# EAGLE board imu_v2 (EAGLE 6.4), part 1 of 2
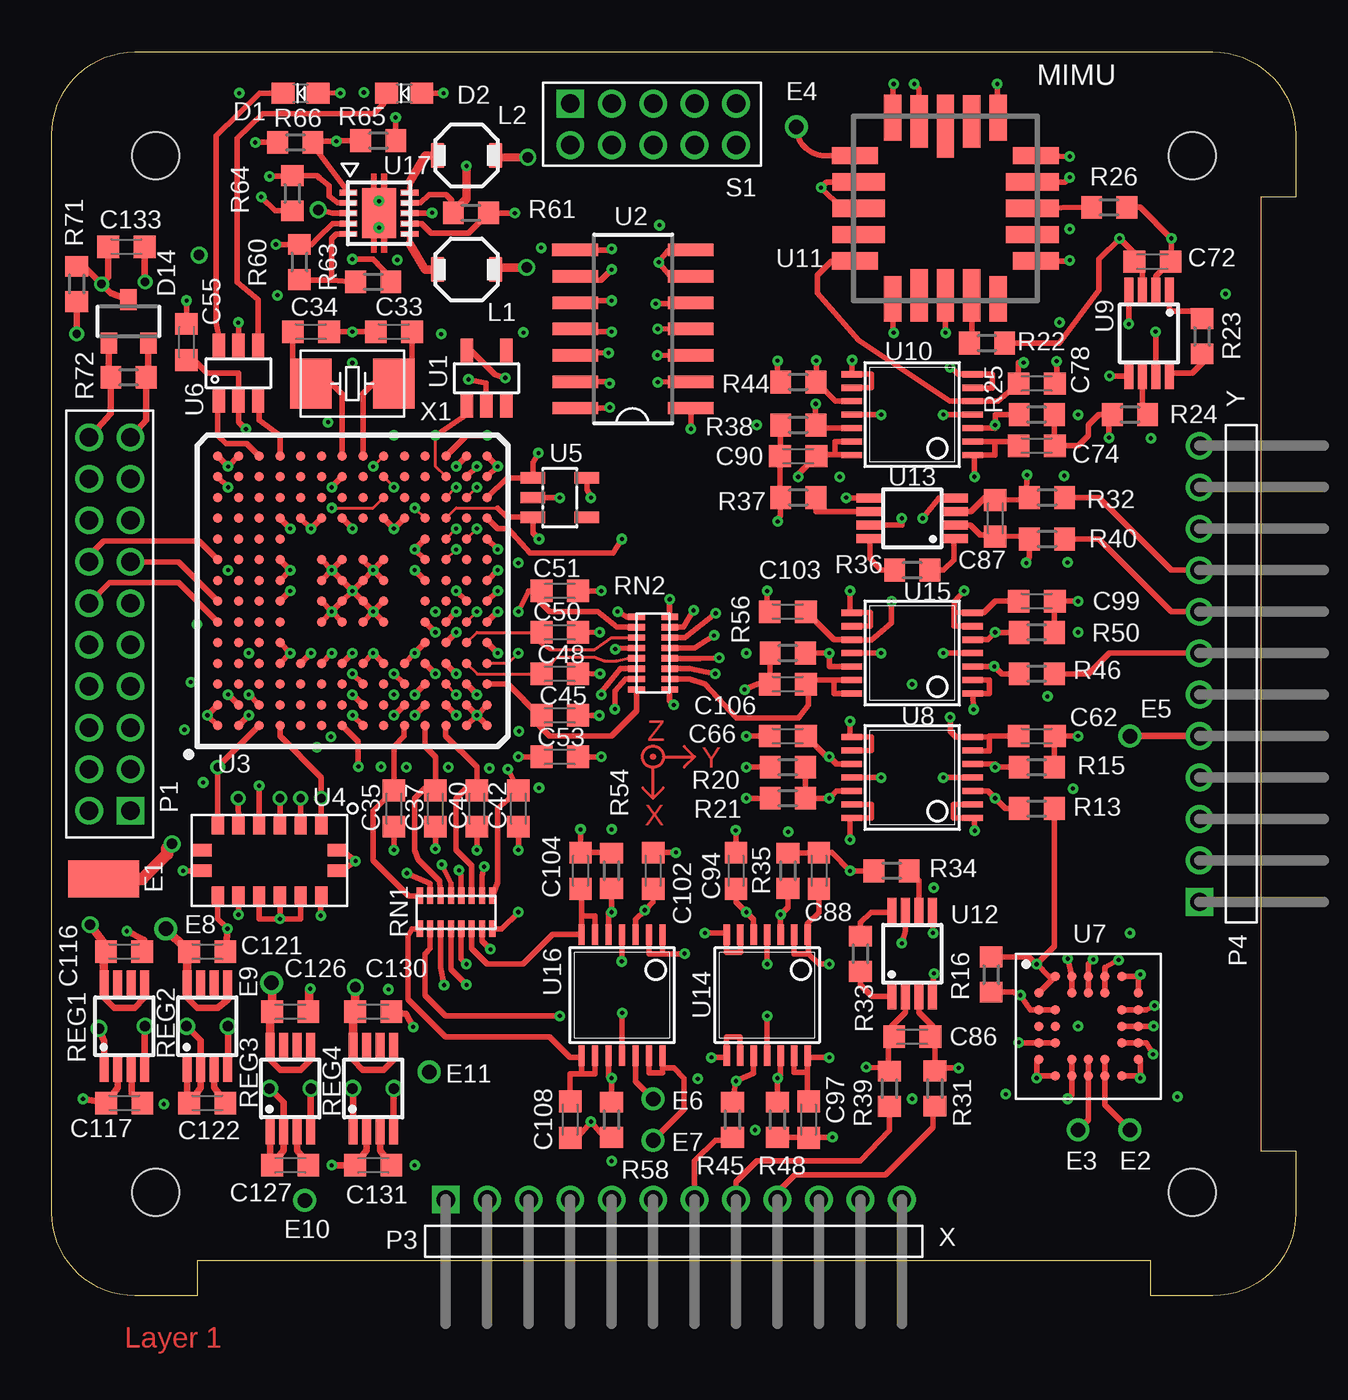
[diagram p4: board, top side]
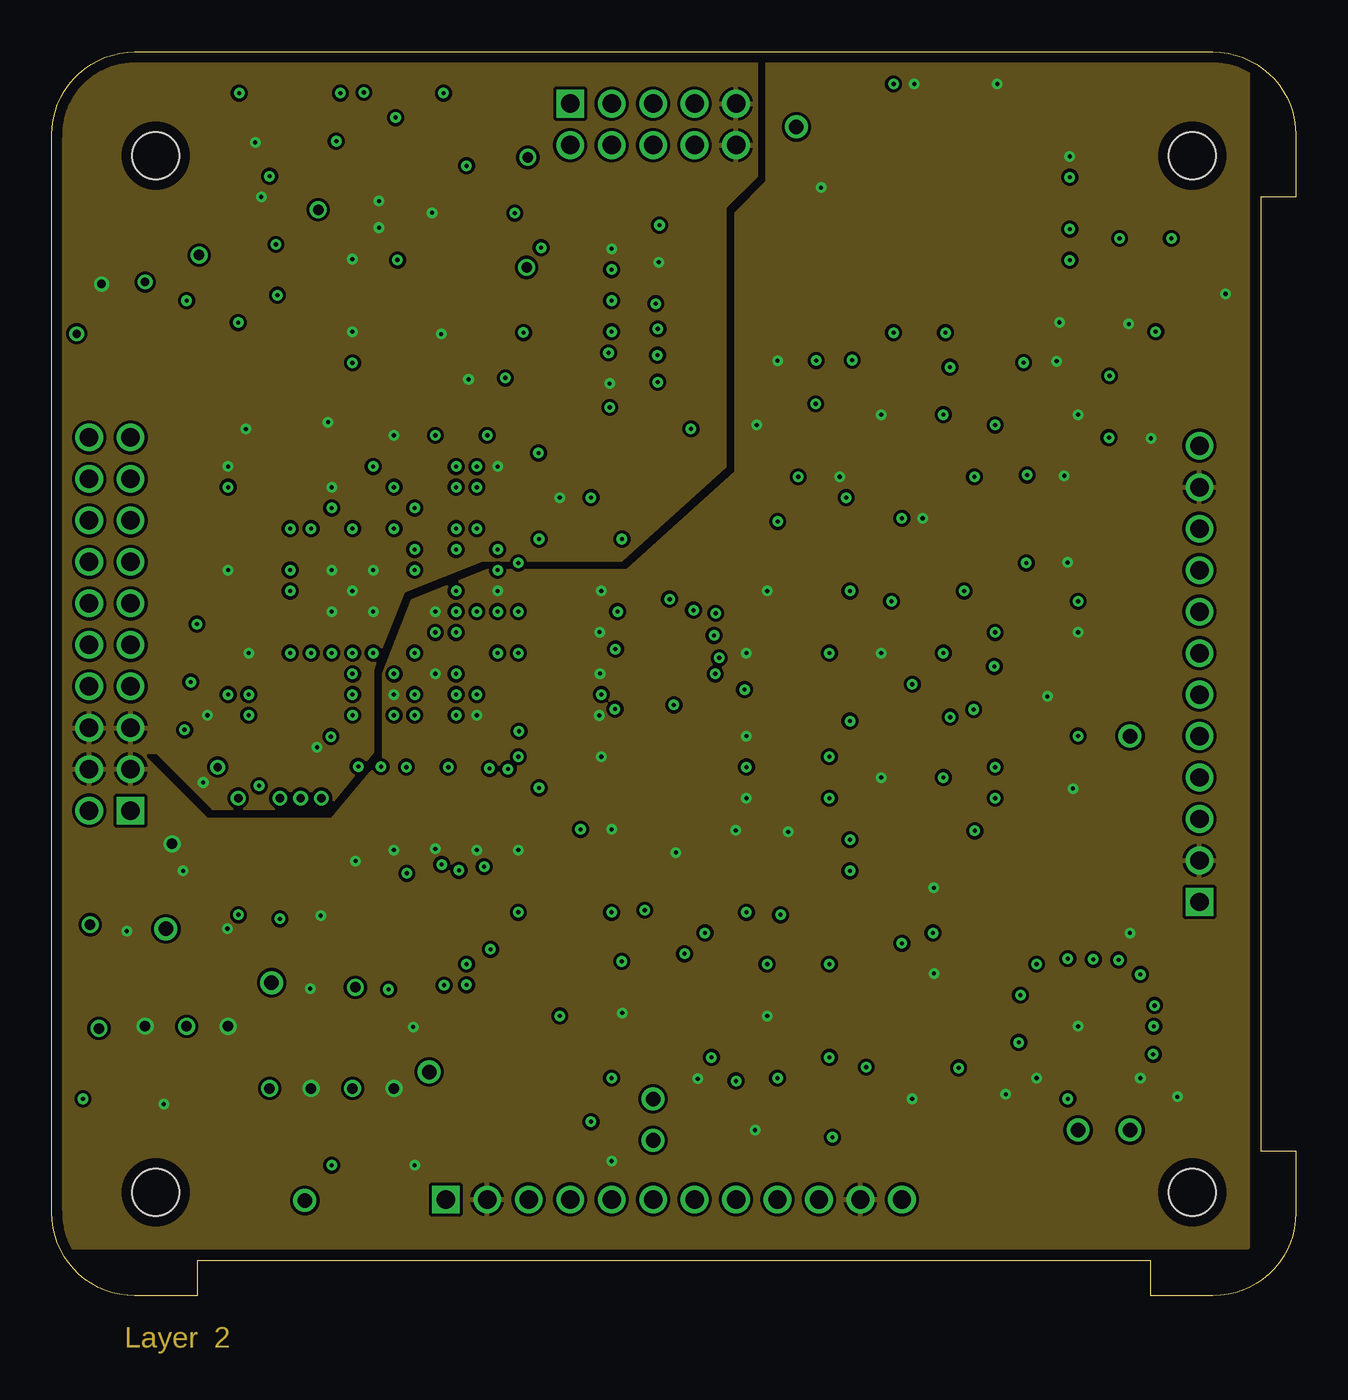
[diagram p5: board, inner layer Gnd]
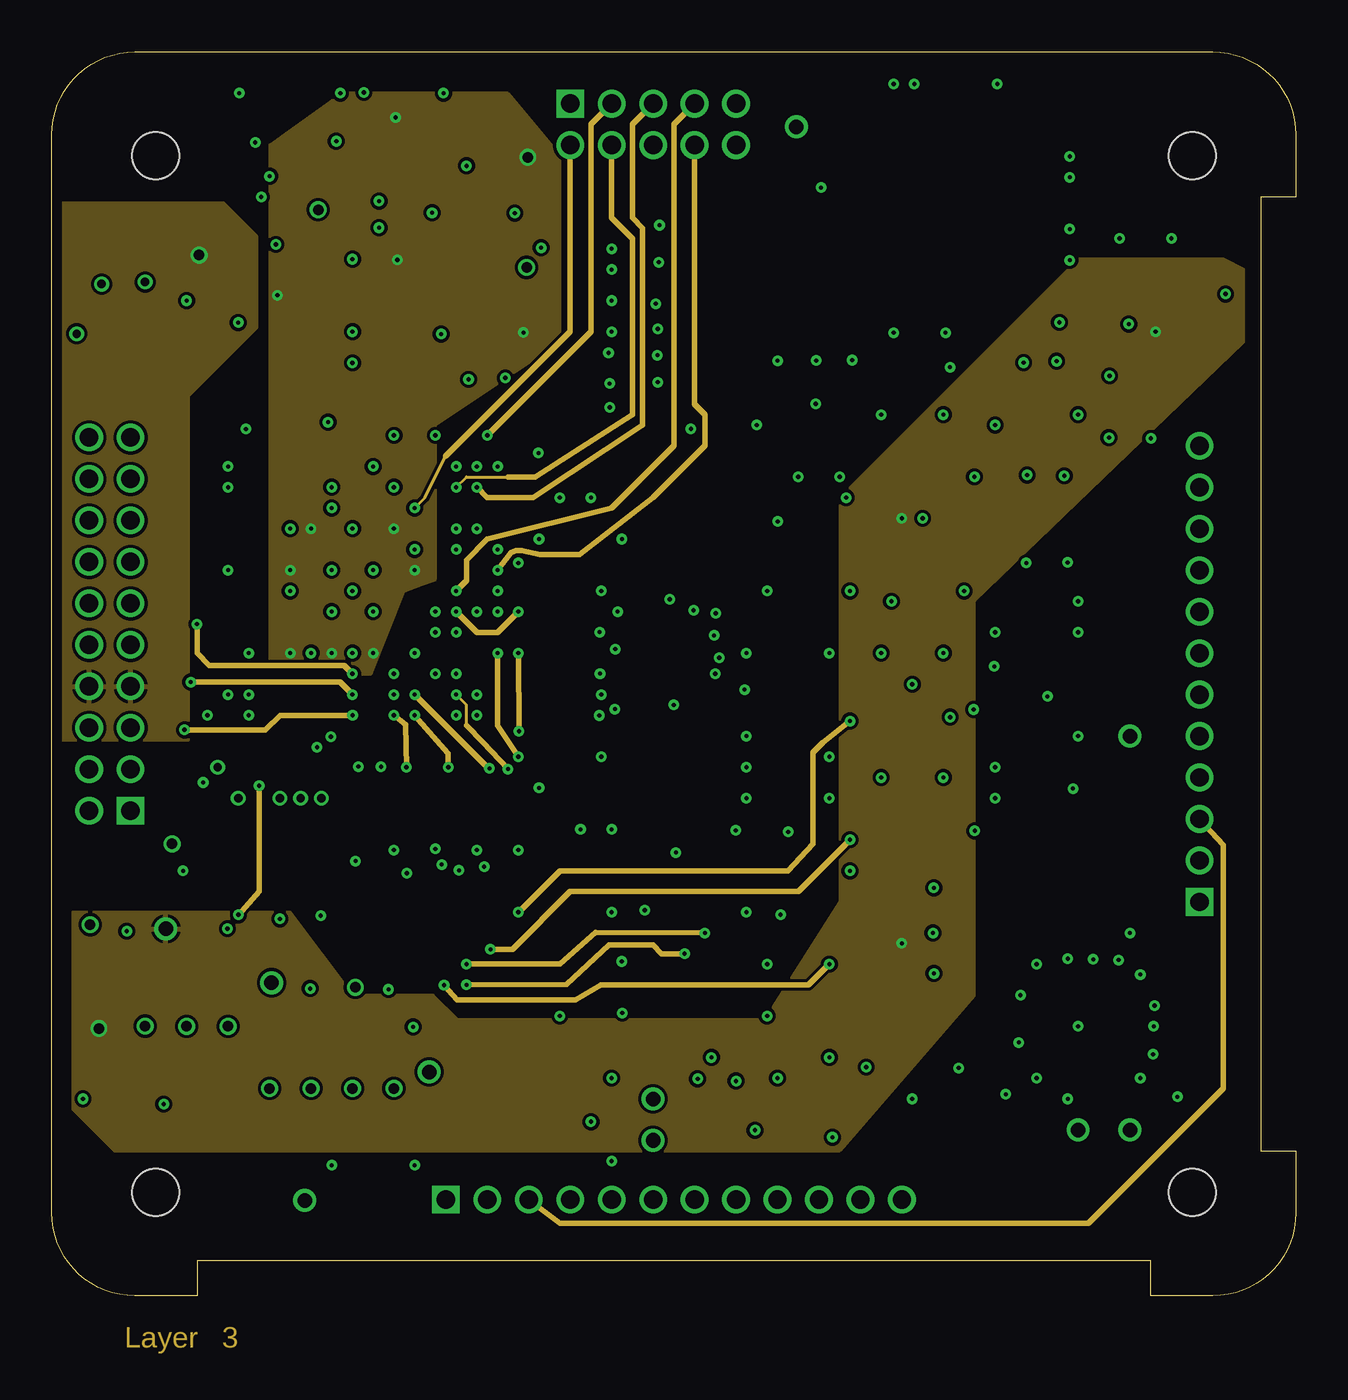
[diagram p6: board, inner layer Sig1]
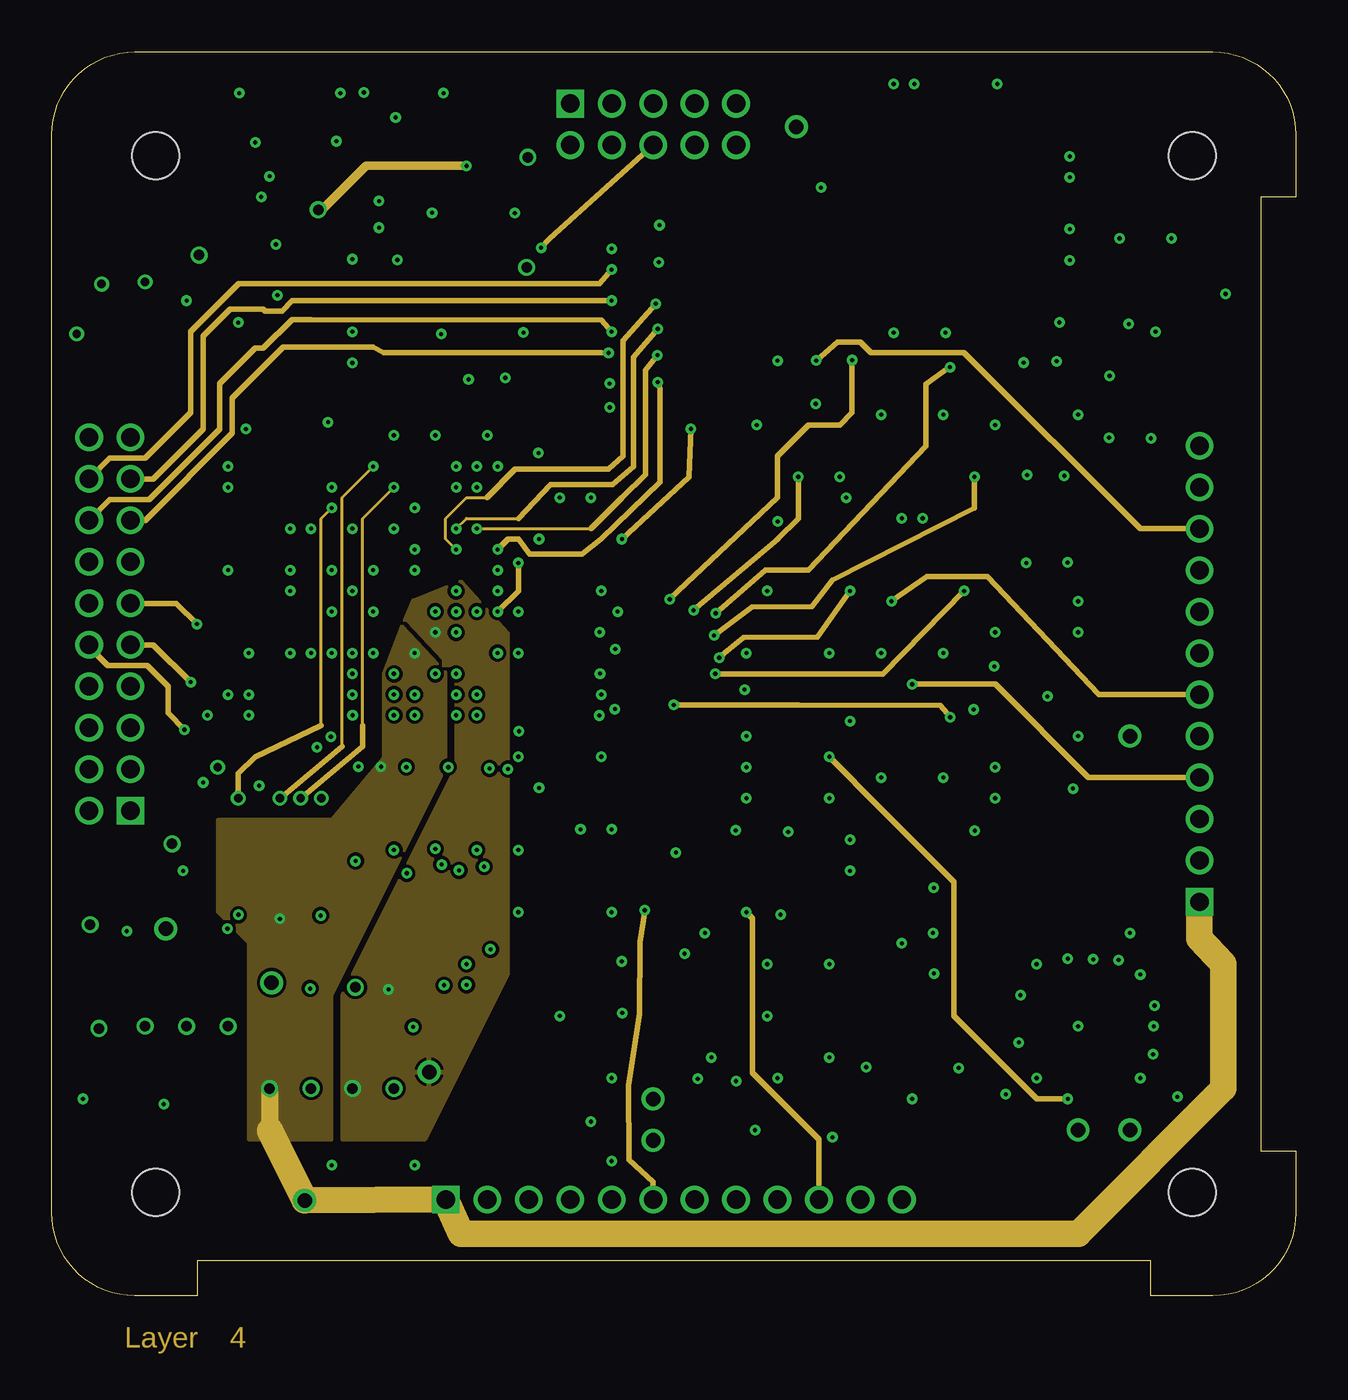
[diagram p7: board, inner layer Sig2]
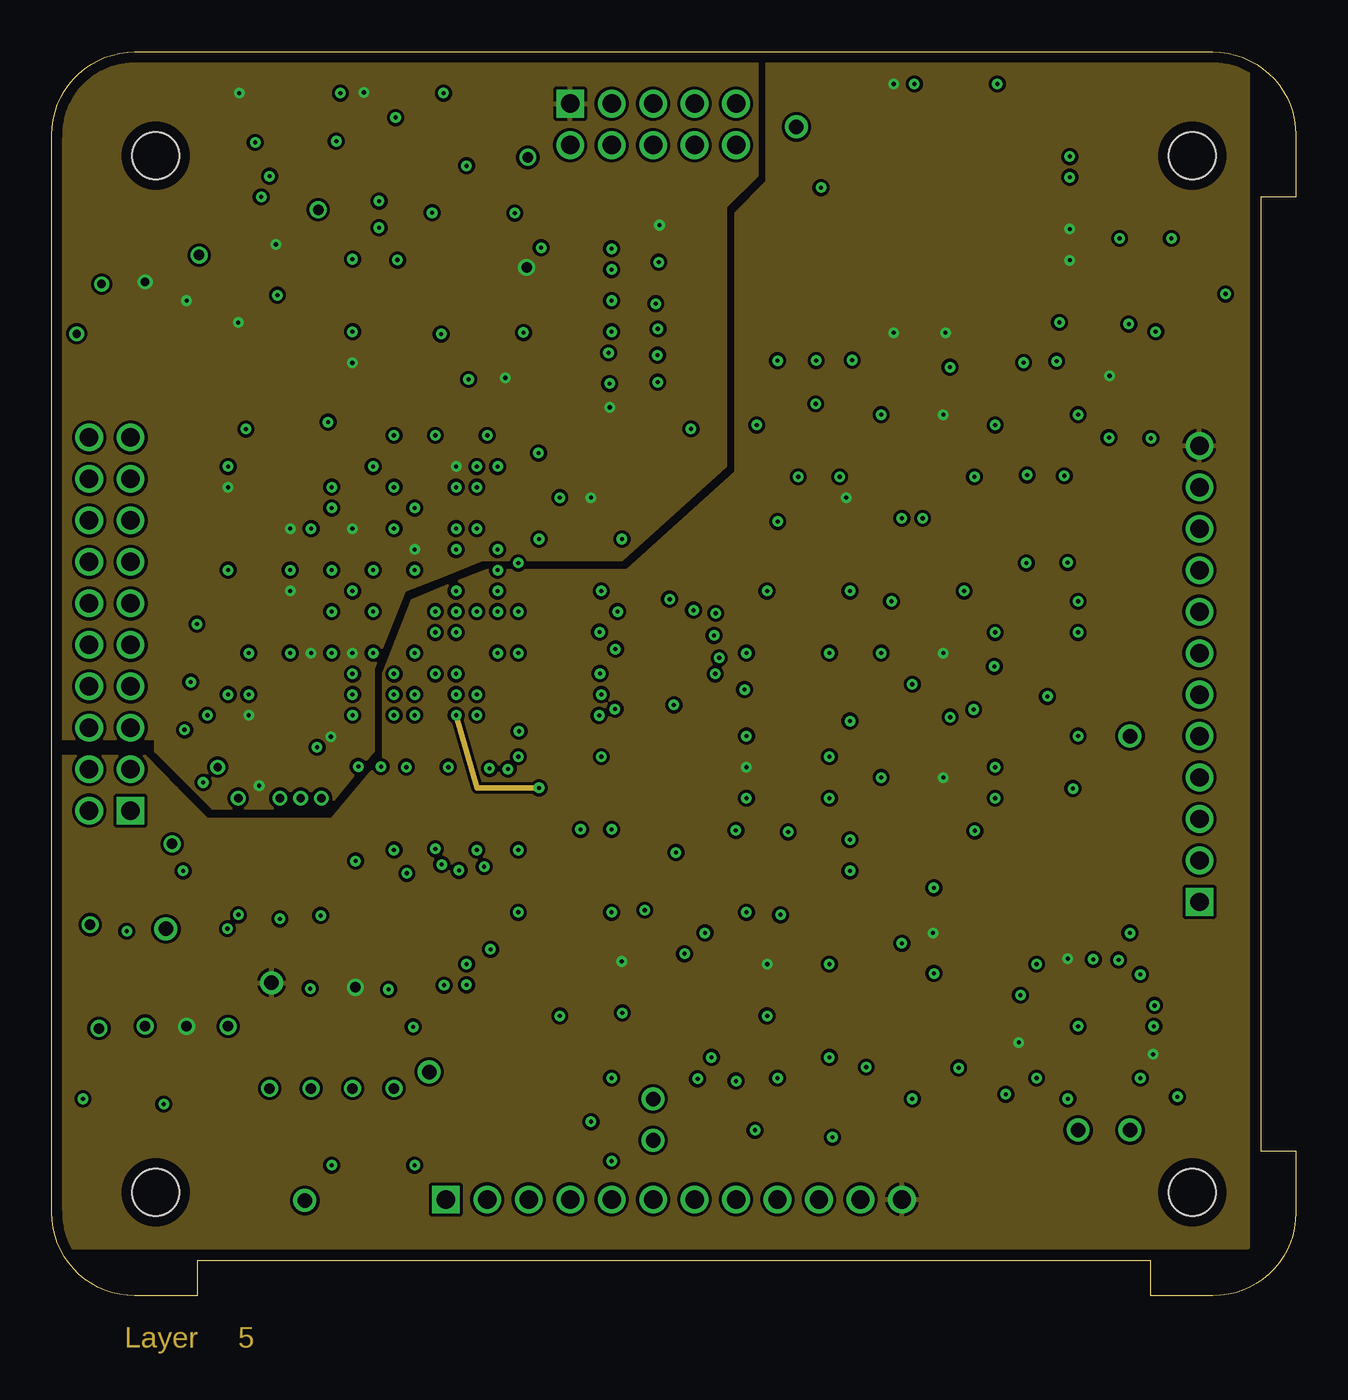
[diagram p8: board, inner layer +3.3V/+5V]
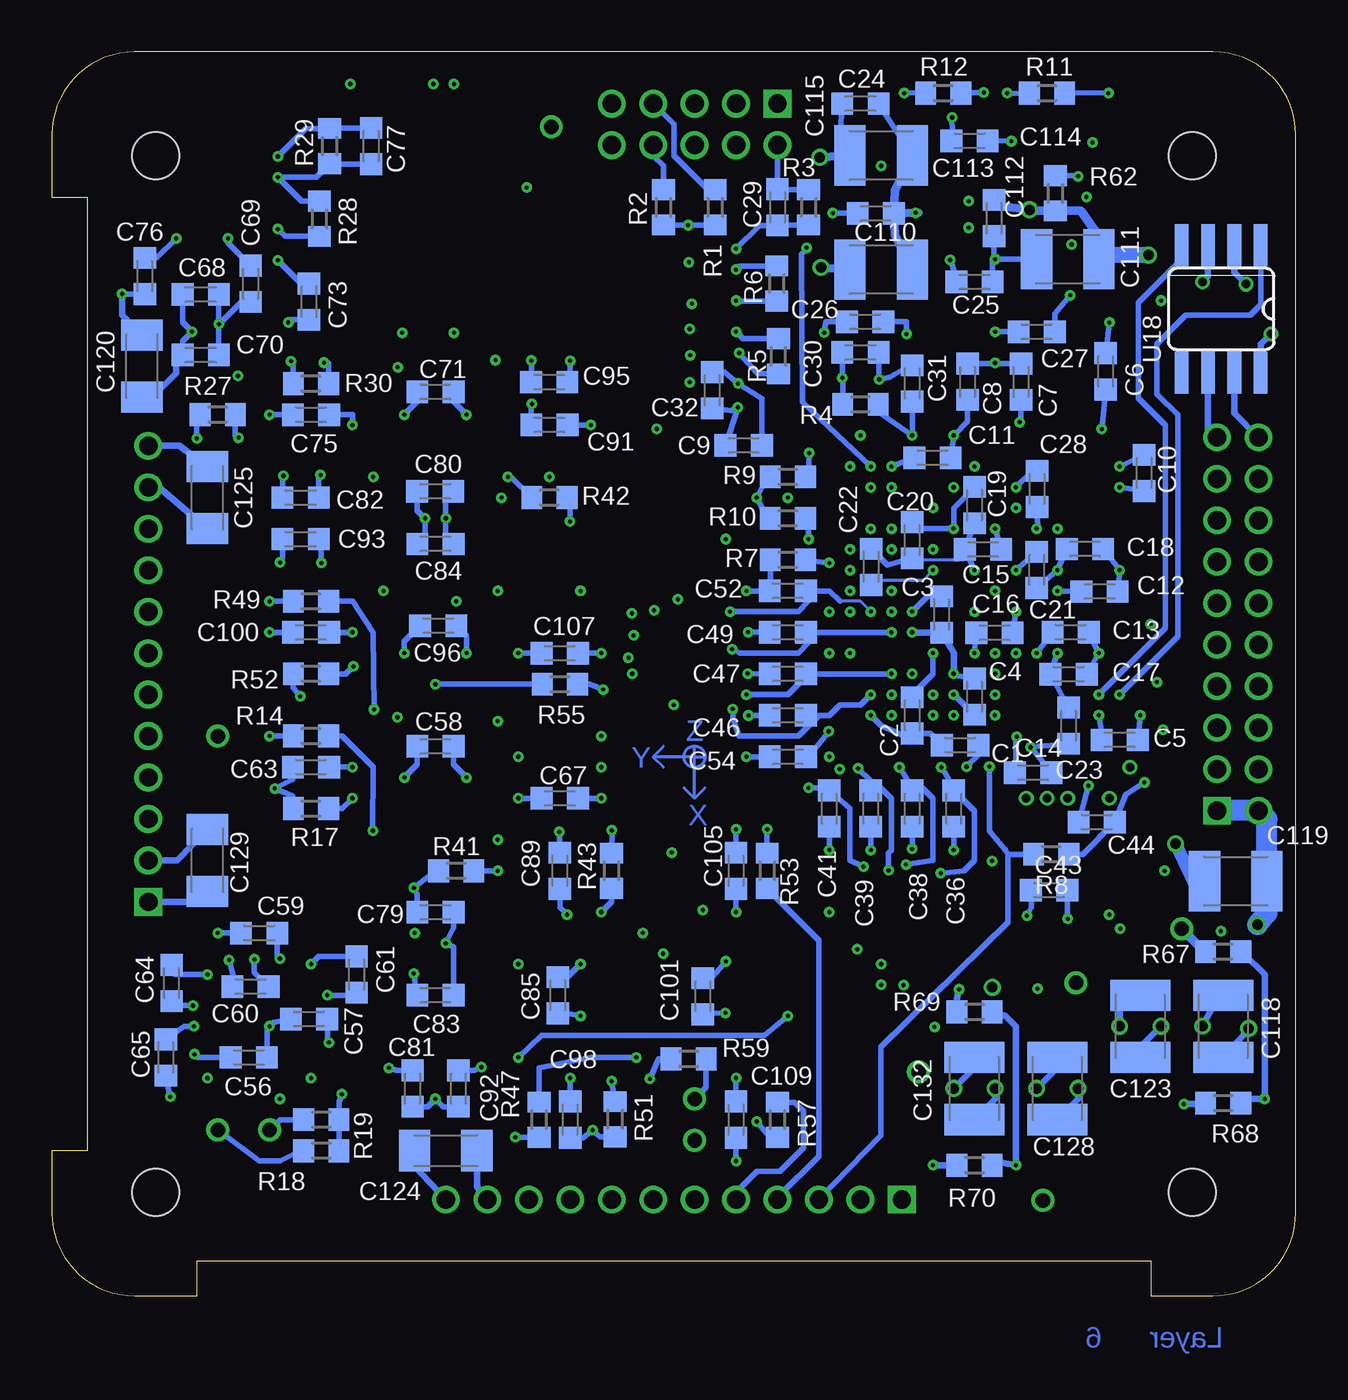
[diagram p9: board, bottom side, seen from below]

Size 60 x 60 mm. Coordinates in mm from the lower left corner, seen from the top.
Outline: 0,56 arc-90 4,60 56,60 arc-90 60,56 60,53 58.3,53 58.3,7 60,7 60,4 arc-90 56,0 53,0 53,1.7 7,1.7 7,0 4,0 arc-90 0,4 0,56
Copper layers (1+2*3+14*15+16): Top 0.0178mm / dielectric 8mil / Gnd 0.0356mm / dielectric 14mil / Sig1 0.0356mm / dielectric 10mil / Sig2 0.0356mm / dielectric 14mil / +3.3V/+5V 0.0356mm / dielectric 8mil / Bottom 0.0178mm
Design rules "BGA_6Layer": minimum track width 6mil, minimum drill 8mil, track to track 6mil, track to pad 6mil, pad to pad 6mil, via to via 6mil, smd to smd 6mil, copper to edge 20mil, drill to drill 16mil, minimum pad ring 8mil, minimum via ring 6mil, stop-mask expansion 3mil, vias tented up to drill 0mil, thermal gap 6mil
Holes 2.26 mm at 5,55 5,5 55,5 55,55

## Footprints (pad centres in the part's own frame; a part is rotated, then mirrored left to right if it is on the bottom)
C0603K = smd 1.05 x 1.08: 1 -0.875,0; 2 0.875,0
C1210K = smd 1.5 x 2.9: 1 -1.5,0; 2 1.5,0
C1206K = smd 1.5 x 2: 1 -1.5,0; 2 1.5,0
LED_0603 = smd 1.1 x 1: A -0.85,0; C 0.85,0
SOT23 = smd 0.8 x 1: 1 -0.95,-1.05; 2 0.95,-1.05; 3 0,1.05
5015_TESTCLIP = smd 3.429 x 1.778: 1 0,0
TP30 = drill 0.7: 1 0,0
VLF3010A = smd 0.65 x 1.2: 1 -1.4,0; 2 1.4,0
HEADER_2X10_2MM = drill 0.889 square: 1 0,0 | drill 0.889: 2 0,2; 3 2,0; 4 2,2; 5 4,0; 6 4,2; 7 6,0; 8 6,2; 9 8,0; 10 8,2; 11 10,0; 12 10,2; 13 12,0; 14 12,2; 15 14,0; 16 14,2; 17 16,0; 18 16,2; 19 18,0; 20 18,2
TMM-112-01-T-S-RA = drill 0.889 square: 1 0,0 | drill 0.889: 2 2,0; 3 4,0; 4 6,0; 5 8,0; 6 10,0; 7 12,0; 8 14,0; 9 16,0; 10 18,0; 11 20,0; 12 22,0
R0603 = smd 1 x 1.1: 1 -0.85,0; 2 0.85,0
MSOP8 = smd 0.432 x 1.27: 1 -0.975,-2.05; 2 -0.325,-2.05; 3 0.325,-2.05; 4 0.975,-2.05; 5 0.975,2.05; 6 0.325,2.05; 7 -0.325,2.05; 8 -0.975,2.05
741X163 = smd 0.8 x 0.3: 1 -0.8,1.75; 2 -0.8,1.25; 3 -0.8,0.75; 4 -0.8,0.25; 5 -0.8,-0.25; 6 -0.8,-0.75; 7 -0.8,-1.25; 8 -0.8,-1.75; 9 0.8,-1.75; 10 0.8,-1.25; 11 0.8,-0.75; 12 0.8,-0.25; 13 0.8,0.25; 14 0.8,0.75; 15 0.8,1.25; 16 0.8,1.75
HEADER_2X5_2MM_TH = drill 0.889 square: 1 0,0 | drill 0.889: 2 0,2; 3 -2,0; 4 -2,2; 5 -4,0; 6 -4,2; 7 -6,0; 8 -6,2; 9 -8,0; 10 -8,2
SOT23-5 = smd 0.6 x 1.2: 1 -0.95,-1.306; 2 0,-1.306; 3 0.95,-1.306; 4 0.95,1.306; 5 -0.95,1.306
SOIC14-NARROW = smd 0.6 x 2.2: 1 -3.683,-2.822; 2 -2.413,-2.822; 3 -1.143,-2.822; 4 0.127,-2.822; 5 1.397,-2.822; 6 2.667,-2.822; 7 3.937,-2.822; 8 3.937,2.766; 9 2.667,2.746; 10 1.397,2.746; 11 0.127,2.746; 12 -1.143,2.746; 13 -2.413,2.746; 14 -3.683,2.746
ZJZ_PBGA176 = smd 0.45 x 0.45: A1 -6.5,6.5; A2 -5.5,6.5; A3 -4.5,6.5; A4 -3.5,6.5; A5 -2.5,6.5; A6 -1.5,6.5; A7 -0.5,6.5; A8 0.5,6.5; A9 1.5,6.5; A10 2.5,6.5; A11 3.5,6.5; A12 4.5,6.5; A13 5.5,6.5; A14 6.5,6.5; B1 -6.5,5.5; B2 -5.5,5.5; B3 -4.5,5.5; B4 -3.5,5.5; B5 -2.5,5.5; B6 -1.5,5.5; B7 -0.5,5.5; B8 0.5,5.5; B9 1.5,5.5; B10 2.5,5.5; B11 3.5,5.5; B12 4.5,5.5; B13 5.5,5.5; B14 6.5,5.5; C1 -6.5,4.5; C2 -5.5,4.5; C3 -4.5,4.5; C4 -3.5,4.5; C5 -2.5,4.5; C6 -1.5,4.5; C7 -0.5,4.5; C8 0.5,4.5; C9 1.5,4.5; C10 2.5,4.5; C11 3.5,4.5; C12 4.5,4.5; C13 5.5,4.5; C14 6.5,4.5; D1 -6.5,3.5; D2 -5.5,3.5; D3 -4.5,3.5; D4 -3.5,3.5; D5 -2.5,3.5; D6 -1.5,3.5; D7 -0.5,3.5; D8 0.5,3.5; D9 1.5,3.5; D10 2.5,3.5; D11 3.5,3.5; D12 4.5,3.5; D13 5.5,3.5; D14 6.5,3.5; E1 -6.5,2.5; E2 -5.5,2.5; E3 -4.5,2.5; E4 -3.5,2.5; E11 3.5,2.5; E12 4.5,2.5; E13 5.5,2.5; E14 6.5,2.5; F1 -6.5,1.5; F2 -5.5,1.5; F3 -4.5,1.5; F4 -3.5,1.5; F6 -1.5,1.5; F7 -0.5,1.5; F8 0.5,1.5; F9 1.5,1.5; F11 3.5,1.5; F12 4.5,1.5; F13 5.5,1.5; F14 6.5,1.5; G1 -6.5,0.5; G2 -5.5,0.5; G3 -4.5,0.5; G4 -3.5,0.5; G6 -1.5,0.5; G7 -0.5,0.5; G8 0.5,0.5; G9 1.5,0.5; G11 3.5,0.5; G12 4.5,0.5; G13 5.5,0.5; G14 6.5,0.5; H1 -6.5,-0.5; H2 -5.5,-0.5; H3 -4.5,-0.5; H4 -3.5,-0.5; H6 -1.5,-0.5; H7 -0.5,-0.5; H8 0.5,-0.5; H9 1.5,-0.5; H11 3.5,-0.5; H12 4.5,-0.5; H13 5.5,-0.5; H14 6.5,-0.5; J1 -6.5,-1.5; J2 -5.5,-1.5; J3 -4.5,-1.5; J4 -3.5,-1.5; J6 -1.5,-1.5; J7 -0.5,-1.5; J8 0.5,-1.5; J9 1.5,-1.5; J11 3.5,-1.5; J12 4.5,-1.5; J13 5.5,-1.5; J14 6.5,-1.5; K1 -6.5,-2.5; K2 -5.5,-2.5; K3 -4.5,-2.5; K4 -3.5,-2.5; K11 3.5,-2.5; K12 4.5,-2.5; K13 5.5,-2.5; K14 6.5,-2.5; L1 -6.5,-3.5; L2 -5.5,-3.5; L3 -4.5,-3.5; L4 -3.5,-3.5; L5 -2.5,-3.5; L6 -1.5,-3.5; L7 -0.5,-3.5; L8 0.5,-3.5; L9 1.5,-3.5; L10 2.5,-3.5; L11 3.5,-3.5; L12 4.5,-3.5; L13 5.5,-3.5; L14 6.5,-3.5; M1 -6.5,-4.5; M2 -5.5,-4.5; M3 -4.5,-4.5; M4 -3.5,-4.5; M5 -2.5,-4.5; M6 -1.5,-4.5; M7 -0.5,-4.5; M8 0.5,-4.5; M9 1.5,-4.5; M10 2.5,-4.5; M11 3.5,-4.5; M12 4.5,-4.5; M13 5.5,-4.5; M14 6.5,-4.5; N1 -6.5,-5.5; N2 -5.5,-5.5; N3 -4.5,-5.5; N4 -3.5,-5.5; N5 -2.5,-5.5; N6 -1.5,-5.5; N7 -0.5,-5.5; N8 0.5,-5.5; N9 1.5,-5.5; N10 2.5,-5.5; N11 3.5,-5.5; N12 4.5,-5.5; N13 5.5,-5.5; N14 6.5,-5.5; P1 -6.5,-6.5; P2 -5.5,-6.5; P3 -4.5,-6.5; P4 -3.5,-6.5; P5 -2.5,-6.5; P6 -1.5,-6.5; P7 -0.5,-6.5; P8 0.5,-6.5; P9 1.5,-6.5; P10 2.5,-6.5; P11 3.5,-6.5; P12 4.5,-6.5; P13 5.5,-6.5; P14 6.5,-6.5
LIS3LV02DL_LGA16 = smd 0.6 x 0.9: 1 -2.5,-1.7; 2 -1.5,-1.7; 3 -0.5,-1.7; 4 0.5,-1.7; 5 1.5,-1.7; 6 2.5,-1.7; 9 2.5,1.7; 10 1.5,1.7; 11 0.5,1.7; 12 -0.5,1.7; 13 -1.5,1.7; 14 -2.5,1.7 | smd 0.9 x 0.6: 7 3.25,-0.5; 8 3.25,0.5; 15 -3.25,0.5; 16 -3.25,-0.5
SOT23-5L = smd 0.55 x 1.2: 1 -0.95,-1.3; 2 0,-1.3; 3 0.95,-1.3; 4 0.95,1.3; 5 -0.95,1.3
SOT23-6 = smd 0.6 x 1.2: 1 -0.95,-1.306; 2 0,-1.306; 3 0.95,-1.306; 4 0.95,1.306; 5 0,1.306; 6 -0.95,1.306
ADXRS_CBGA32 = smd 0.47 x 0.47: 1B -2.4,1.6; 1C -2.4,0.8; 1D -2.4,0; 1E -2.4,-0.8; 1F -2.4,-1.6; 2A -1.6,2.4; 2C -1.6,0.8; 2D -1.6,0; 2E -1.6,-0.8; 2G -1.6,-2.4; 3A -0.8,2.4; 3B -0.8,1.6; 3F -0.8,-1.6; 3G -0.8,-2.4; 4A 0,2.4; 4B 0,1.6; 4F 0,-1.6; 4G 0,-2.4; 5A 0.8,2.4; 5B 0.8,1.6; 5F 0.8,-1.6; 5G 0.8,-2.4; 6A 1.6,2.4; 6C 1.6,0.8; 6D 1.6,0; 6E 1.6,-0.8; 6G 1.6,-2.4; 7B 2.4,1.6; 7C 2.4,0.8; 7D 2.4,0; 7E 2.4,-0.8; 7F 2.4,-1.6
TSSOP14 = smd 0.305 x 0.991: 1 -1.95,-2.918; 2 -1.3,-2.918; 3 -0.65,-2.918; 4 0,-2.918; 5 0.65,-2.918; 6 1.3,-2.918; 7 1.95,-2.918; 8 1.95,2.918; 9 1.3,2.918; 10 0.65,2.918; 11 0,2.918; 12 -0.65,2.918; 13 -1.3,2.918; 14 -1.95,2.918
1221_LCC = smd 0.838 x 3.048: 1 0,3.962 | smd 0.838 x 2.54: 2 -1.27,4.191; 10 -1.27,-4.191; 11 0,-4.191; 12 1.27,-4.191; 20 1.27,4.191 | smd 0.838 x 2.21: 3 -2.54,4.369; 9 -2.54,-4.369; 13 2.54,-4.369; 19 2.54,4.369 | smd 2.21 x 0.838: 4 -4.369,2.54; 8 -4.369,-2.54; 14 4.369,-2.54; 18 4.369,2.54 | smd 2.54 x 0.838: 5 -4.191,1.27; 6 -4.191,0; 7 -4.191,-1.27; 15 4.191,-1.27; 16 4.191,0; 17 4.191,1.27
QFN10 = smd 0.28 x 0.85: 1 -1,-1.475; 2 -0.5,-1.475; 3 0,-1.475; 4 0.5,-1.475; 5 1,-1.475; 6 1,1.475; 7 0.5,1.475; 8 0,1.475; 9 -0.5,1.475; 10 -1,1.475 | smd 2.4 x 1.65: PWRPAD 0,0
SO08 = smd 0.66 x 2.032: 1 -1.905,-3.073; 2 -0.635,-3.073; 3 0.635,-3.073; 4 1.905,-3.073; 5 1.905,3.073; 6 0.635,3.073; 7 -0.635,3.073; 8 -1.905,3.073
NX5032GA = smd 2 x 2.4: 1 -2,0; 2 2,0

## Placement (x,y rotation side)
C1  0.1UF  [C0603K]  16.19,26.56 180 bottom
C2  0.1UF  [C0603K]  18.5,28 270 bottom
C3  0.1UF  [C0603K]  17.09,32.86 90 bottom
C4  0.1UF  [C0603K]  15.5,28.9 270 bottom
C5  0.1UF  [C0603K]  8.49,26.81 0 bottom
C6  0.1UF  [C0603K]  9.17,44.59 270 bottom
C7  0.1UF  [C0603K]  13.25,44.09 270 bottom
C8  0.1UF  [C0603K]  15.83,44.09 270 bottom
C9  0.1UF  [C0603K]  26.63,41.02 0 bottom
C10  0.1UF  [C0603K]  7.31,39.69 90 bottom
C11  0.1UF  [C0603K]  17.52,40.42 0 bottom
C12  0.1UF  [C0603K]  9.47,33.97 0 bottom
C13  0.1UF  [C0603K]  10.86,32.01 0 bottom
C14  0.1UF  [C0603K]  12.67,25.23 0 bottom
C15  0.1UF  [C0603K]  15.09,36 180 bottom
C16  0.1UF  [C0603K]  14.53,31.98 0 bottom
C17  0.1UF  [C0603K]  10.96,29.98 0 bottom
C18  0.1UF  [C0603K]  10.17,36.02 0 bottom
C19  0.1UF  [C0603K]  15.5,38.14 270 bottom
C20  0.1UF  [C0603K]  18.51,36.45 270 bottom
C21  0.1UF  [C0603K]  12.5,35.01 90 bottom
C22  0.1UF  [C0603K]  20.49,35.16 90 bottom
C23  0.1UF  [C0603K]  10.96,27.5 270 bottom
C24  0.1UF  [C0603K]  21,57.5 0 bottom
C25  0.1UF  [C0603K]  15.5,48.9 0 bottom
C26  0.1UF  [C0603K]  20.77,46.98 0 bottom
C27  0.1UF  [C0603K]  12.5,46.5 180 bottom
C28  0.1UF  [C0603K]  12.48,38.92 90 bottom
C29  0.01UF  [C0603K]  25,52.5 270 bottom
C30  0.1UF  [C0603K]  21,45.5 0 bottom
C31  0.1UF  [C0603K]  18.5,44 90 bottom
C32  0.1UF  [C0603K]  28.15,43.68 90 bottom
C33  16PF  [C0603K]  16.5,46.5 180 top
C34  16PF  [C0603K]  12.5,46.5 0 top
C35  220PF  [C0603K]  16.5,23.5 270 top
C36  220PF  [C0603K]  16.5,23.5 270 bottom
C37  220PF  [C0603K]  18.5,23.5 270 top
C38  220PF  [C0603K]  18.5,23.5 270 bottom
C39  220PF  [C0603K]  20.5,23.5 270 bottom
C40  220PF  [C0603K]  20.5,23.5 270 top
C41  220PF  [C0603K]  22.5,23.5 270 bottom
C42  220PF  [C0603K]  22.5,23.5 270 top
C43  0.1UF  [C0603K]  11.9,19.57 180 bottom
C44  0.1UF  [C0603K]  9.6,22.85 0 bottom
C45  220PF  [C0603K]  24.5,28 0 top
C46  220PF  [C0603K]  24.5,28 180 bottom
C47  220PF  [C0603K]  24.5,30 180 bottom
C48  220PF  [C0603K]  24.5,30 0 top
C49  220PF  [C0603K]  24.5,32 180 bottom
C50  220PF  [C0603K]  24.5,32 0 top
C51  220PF  [C0603K]  24.5,34 0 top
C52  220PF  [C0603K]  24.5,34 180 bottom
C53  2.2UF  [C0603K]  24.5,26 0 top
C54  2.2UF  [C0603K]  24.5,26 180 bottom
C55  0.1UF  [C0603K]  6.5,46 270 top
C56  0.1UF  [C0603K]  50.5,11.5 0 bottom
C57  0.1UF  [C0603K]  47.6,13.35 180 bottom
C58  0.1UF  [C0603K]  41.5,26.5 0 bottom
C59  0.1UF  [C0603K]  50,17.5 180 bottom
C60  0.022UF  [C0603K]  50.42,14.92 0 bottom
C61  0.027UF  [C0603K]  45.3,15.5 270 bottom
C62  0.47UF  [C0603K]  47.5,27 180 top
C63  0.22UF  [C0603K]  47.5,25.5 180 bottom
C64  0.022UF  [C0603K]  54.22,15.09 90 bottom
C65  0.1UF  [C0603K]  54.5,11.5 270 bottom
C66  0.1UF  [C0603K]  35.5,27 180 top
C67  0.1UF  [C0603K]  35.5,24 0 bottom
C68  0.1UF  [C0603K]  52.82,48.3 0 bottom
C69  1000PF  [C0603K]  50.41,48.81 90 bottom
C70  1UF  [C0603K]  52.82,45.38 0 bottom
C71  0.1UF  [C0603K]  41.5,43.6 0 bottom
C72  0.22UF  [C0603K]  53.08,49.88 0 top
C73  0.1UF  [C0603K]  47.6,47.95 270 bottom
C74  0.47UF  [C0603K]  47.5,41 180 top
C75  0.22UF  [C0603K]  47.5,42.5 180 bottom
C76  1000PF  [C0603K]  55.51,49.19 270 bottom
C77  0.01UF  [C0603K]  44.6,55.45 90 bottom
C78  1UF  [C0603K]  47.5,44 0 top
C79  0.1UF  [C0603K]  41.5,18.5 180 bottom
C80  0.1UF  [C0603K]  41.51,38.81 180 bottom
C81  1000PF  [C0603K]  42.6,10 90 bottom
C82  1000PF  [C0603K]  48,38.5 0 bottom
C83  1UF  [C0603K]  41.5,14.5 180 bottom
C84  1UF  [C0603K]  41.5,36.26 180 bottom
C85  0.1UF  [C0603K]  35.6,14.5 270 bottom
C86  0.22UF  [C0603K]  41.5,12.5 180 top
C87  0.22UF  [C0603K]  45.5,37.5 270 top
C88  0.47UF  [C0603K]  37,20.5 270 top
C89  0.22UF  [C0603K]  35.5,20.5 90 bottom
C90  0.47UF  [C0603K]  36,40.5 0 top
C91  0.22UF  [C0603K]  36,42 0 bottom
C92  1000PF  [C0603K]  40.39,10 270 bottom
C93  1000PF  [C0603K]  48,36.5 180 bottom
C94  1UF  [C0603K]  33,20.5 90 top
C95  1UF  [C0603K]  36.01,44.07 0 bottom
C96  0.1UF  [C0603K]  41.37,32.32 0 bottom
C97  0.47UF  [C0603K]  36.5,8.5 90 top
C98  0.22UF  [C0603K]  35,8.5 270 bottom
C99  0.47UF  [C0603K]  47.5,33.5 180 top
C100  0.22UF  [C0603K]  47.5,32 180 bottom
C101  0.1UF  [C0603K]  28.6,14.45 270 bottom
C102  0.1UF  [C0603K]  29,20.5 90 top
C103  0.1UF  [C0603K]  35.5,33 180 top
C104  0.47UF  [C0603K]  25.5,20.5 270 top
C105  0.22UF  [C0603K]  27,20.5 90 bottom
C106  0.47UF  [C0603K]  35.5,29.5 0 top
C107  0.22UF  [C0603K]  35.5,31 0 bottom
C108  0.47UF  [C0603K]  25,8.5 90 top
C109  0.22UF  [C0603K]  27,8.5 270 bottom
C110  22UF  [C1210K]  20,49.5 0 bottom
C111  22UF  [C1210K]  11,50 180 bottom
C112  0.1UF  [C0603K]  14.56,51.98 270 bottom
C113  0.01UF  [C0603K]  20.26,52.2 0 bottom
C114  33PF  [C0603K]  15.74,55.71 0 bottom
C115  22UF  [C1210K]  20,55 0 bottom
C116  1UF  [C0603K]  3.49,16.61 0 top
C117  0.01UF  [C0603K]  3.5,9.3 0 top
C118  22UF  [C1210K]  3.5,13 90 bottom
C119  22UF  [C1210K]  2.9,20 180 bottom
C120  10UF  [C1206K]  55.66,44.84 90 bottom
C121  1UF  [C0603K]  7.5,16.6 0 top
C122  0.01UF  [C0603K]  7.5,9.3 0 top
C123  22UF  [C1210K]  7.5,13 90 bottom
C124  10UF  [C1206K]  41,7 0 bottom
C125  10UF  [C1206K]  52.5,38.5 270 bottom
C126  1UF  [C0603K]  11.5,13.7 0 top
C127  0.01UF  [C0603K]  11.5,6.3 0 top
C128  22UF  [C1210K]  11.5,10 90 bottom
C129  10UF  [C1206K]  52.5,21 90 bottom
C130  1UF  [C0603K]  15.5,13.7 0 top
C131  0.01UF  [C0603K]  15.5,6.3 0 top
C132  22UF  [C1210K]  15.5,10 90 bottom
C133  0.1UF  [C0603K]  3.6,50.6 180 top
D1  LED_0603  [LED_0603]  12,58 180 top
D2  LED_0603  [LED_0603]  17,58 180 top
D14  PSM712  [SOT23]  3.7,47 0 top
E1  5015_TESTCLIP  [5015_TESTCLIP]  2.5,20.1 180 top
E2  TP30  [TP30]  52,8 0 top
E3  TP30  [TP30]  49.5,8 0 top
E4  TP30  [TP30]  35.91,56.38 0 top
E5  TP30  [TP30]  52,27 0 top
E6  TP30  [TP30]  29,9.5 90 top
E7  TP30  [TP30]  29,7.5 0 top
E8  TP30  [TP30]  5.5,17.7 0 top
E9  TP30  [TP30]  10.6,15.1 0 top
E10  TP30  [TP30]  12.2,4.6 0 top
E11  TP30  [TP30]  18.2,10.8 0 top
L1  2.2UH  [VLF3010A]  20,49.5 0 top
L2  3.3UH  [VLF3010A]  20,55 0 top
P1  HEADER_2X10_2MM  [HEADER_2X10_2MM]  3.8,23.4 90 top
P3  HEADER_12PIN_2MMRA_TH  [TMM-112-01-T-S-RA]  19,4.65 0 top
P4  HEADER_12PIN_2MMRA_TH  [TMM-112-01-T-S-RA]  55.35,19 90 top
R1  4.64K  [R0603]  28,52.5 270 bottom
R2  4.64K  [R0603]  30.5,52.5 270 bottom
R3  2.21K  [R0603]  23.5,52.5 270 bottom
R4  2.21K  [R0603]  21,43 0 bottom
R5  120  [R0603]  24.96,45.32 270 bottom
R6  120  [R0603]  25.04,48.82 270 bottom
R7  22.1K  [R0603]  24.5,35.5 0 bottom
R8  10K  [R0603]  11.8,21.3 180 bottom
R9  1K  [R0603]  24.5,39.5 0 bottom
R10  1K  [R0603]  24.5,37.5 0 bottom
R11  511  [R0603]  12,58 0 bottom
R12  511  [R0603]  17,58 0 bottom
R13  12K  [R0603]  47.5,23.5 0 top
R14  4.87K  [R0603]  47.5,27 0 bottom
R15  9.53K  [R0603]  47.5,25.5 0 top
R16  226K  [R0603]  45.3,15.5 90 top
R17  20K  [R0603]  47.5,23.5 180 bottom
R18  10K  [R0603]  47,7 180 bottom
R19  10K  [R0603]  47,8.5 180 bottom
R20  4.99K  [R0603]  35.5,25.5 0 top
R21  4.99K  [R0603]  35.5,24 0 top
R22  5.36K  [R0603]  45.1,45.95 0 top
R23  DNL  [R0603]  55.48,46.28 90 top
R24  16.2K  [R0603]  52,42.5 180 top
R25  9.53K  [R0603]  47.5,42.5 0 top
R26  5.36K  [R0603]  51,52.5 0 top
R27  6.98K  [R0603]  52,42.5 0 bottom
R28  4.99K  [R0603]  47.1,51.95 270 bottom
R29  4.99K  [R0603]  46.6,55.45 270 bottom
R30  2K  [R0603]  47.5,44 180 bottom
R31  5.36K  [R0603]  42.59,10 90 top
R32  5.36K  [R0603]  48,38.5 180 top
R33  DNL  [R0603]  39,16.5 270 top
R34  16.2K  [R0603]  40.5,20.5 180 top
R35  9.53K  [R0603]  35.5,20.5 90 top
R36  DNL  [R0603]  41.5,35 0 top
R37  16.2K  [R0603]  36,38.5 180 top
R38  9.53K  [R0603]  36,42 180 top
R39  5.36K  [R0603]  40.4,9.99 90 top
R40  5.36K  [R0603]  48,36.5 180 top
R41  6.98K  [R0603]  40.5,20.5 0 bottom
R42  6.98K  [R0603]  36,38.5 0 bottom
R43  2K  [R0603]  33,20.5 90 bottom
R44  2K  [R0603]  36,44.07 180 top
R45  12K  [R0603]  32.83,8.5 270 top
R46  12K  [R0603]  47.5,30 0 top
R47  4.87K  [R0603]  36.5,8.5 90 bottom
R48  9.53K  [R0603]  35,8.5 270 top
R49  4.87K  [R0603]  47.5,33.5 0 bottom
R50  9.53K  [R0603]  47.5,32 0 top
R51  20K  [R0603]  32.83,8.52 270 bottom
R52  20K  [R0603]  47.5,30 180 bottom
R53  4.87K  [R0603]  25.5,20.5 270 bottom
R54  9.53K  [R0603]  27,20.5 90 top
R55  4.87K  [R0603]  35.5,29.5 180 bottom
R56  9.53K  [R0603]  35.5,31 180 top
R57  4.87K  [R0603]  25,8.5 90 bottom
R58  9.53K  [R0603]  27,8.5 270 top
R59  10K  [R0603]  29.29,11.43 180 bottom
R60  220K  [R0603]  11.94,49.86 270 top
R61  14.7K  [R0603]  20.21,52.23 0 top
R62  10K  [R0603]  11.6,53.18 90 bottom
R63  49.9K  [R0603]  15.5,48.9 0 top
R64  DNL  [R0603]  11.6,53.18 270 top
R65  147K  [R0603]  15.74,55.71 0 top
R66  68K  [R0603]  11.74,55.63 0 top
R67  20K  [R0603]  3.5,16.6 0 bottom
R68  2.8K  [R0603]  3.5,9.3 180 bottom
R69  1K  [R0603]  15.5,13.7 0 bottom
R70  1.78K  [R0603]  15.5,6.3 180 bottom
R71  0  [R0603]  1.2,48.8 270 top
R72  120  [R0603]  3.7,44.3 180 top
REG1  LT1962EMS8  [MSOP8]  3.5,13 0 top
REG2  LT1962EMS8-5  [MSOP8]  7.5,13 0 top
REG3  LT1962EMS8-3.3  [MSOP8]  11.5,10 0 top
REG4  LT1962EMS8  [MSOP8]  15.5,10 0 top
RN1  741X163-56R  [741X163]  19.5,18.5 270 top
RN2  741X163-56R  [741X163]  29,31 180 top
S1  MMS-105-01-L-DV  [HEADER_2X5_2MM_TH]  25,57.5 180 top
U1  TPS3828-33  [SOT23-5]  20.96,44.26 0 top
U2  MAX3079EESD  [SOIC14-NARROW]  28,46.5 90 top
U3  TMS320F28335ZJZ  [ZJZ_PBGA176]  14.5,34 90 top
U4  LIS3LV02DL  [LIS3LV02DL_LGA16]  10.5,21 180 top
U5  DS28CM00  [SOT23-5L]  24.5,38.5 270 top
U6  SN74LVC2G07  [SOT23-6]  9,44.5 0 top
U7  ADXRS642BBZG  [ADXRS_CBGA32]  50,13 0 top
U8  OPA4376AIPW  [TSSOP14]  41.5,25 90 top
U9  AD623ARM  [MSOP8]  52.92,46.42 180 top
U10  OPA4376AIPW  [TSSOP14]  41.5,42.5 90 top
U11  ACCEL_1221  [1221_LCC]  43.1,52.45 0 top
U12  AD623ARM  [MSOP8]  41.5,16.5 0 top
U13  AD623ARM  [MSOP8]  41.5,37.5 90 top
U14  OPA4376AIPW  [TSSOP14]  34.5,14.5 180 top
U15  OPA4376AIPW  [TSSOP14]  41.5,31 90 top
U16  OPA4376AIPW  [TSSOP14]  27.5,14.5 180 top
U17  TPS62400DRC  [QFN10]  15.78,52.21 270 top
U18  SN65HVD230D  [SO08]  3.6,47.6 180 bottom
X1  NX5032GA-30.000000MHZ  [NX5032GA]  14.5,44 180 top